# EAGLE design Silicoin (EAGLE 6.4)
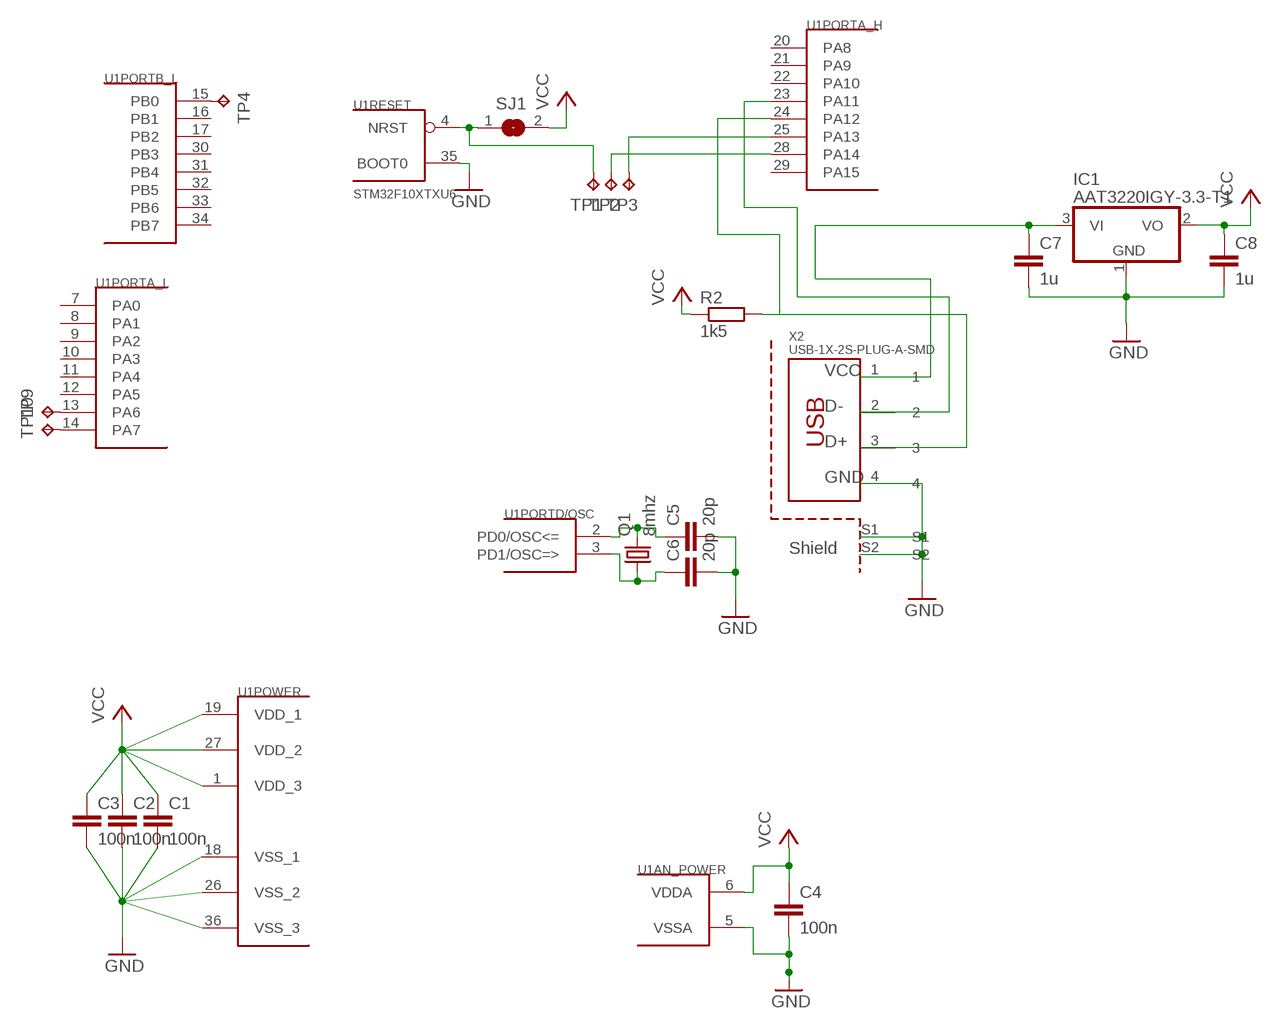
[diagram p0: schematic, sheet 1]

## Parts
C1  100n  C-EUC0603  [C0603]
C2  100n  C-EUC0603  [C0603]
C3  100n  C-EUC0603  [C0603]
C4  100n  C-EUC0603  [C0603]
C5  20p  C-EUC0603  [C0603]
C6  20p  C-EUC0603  [C0603]
C7  1u  C-EUC0603  [C0603]
C8  1u  C-EUC0603  [C0603]
IC1  AAT3220IGY-3.3-T1  MCP1703CB  [SOT23]
Q1  8mhz  CSM-7X-DU  [CSM-7X-DU]
R2  1k5  R-EU_R0603  [R0603]
SJ1  SJ  [SJ]
TP1  TPB2,54  [B2,54]
TP2  TPB2,54  [B2,54]
TP3  TPB2,54  [B2,54]
TP4  TPB2,54  [B2,54]
TP9  TPB2,54  [B2,54]
TP10  TPB2,54  [B2,54]
U1  STM32F10XTXU6  [VFQFPN36]
X2  USB-1X-2S-PLUG-A-SMD  [USB-PLUG-A-SMD-2S]

## Nets
GND: C1.2 C2.2 C3.2 C4.2 C5.2 C6.2 C7.2 C8.2 IC1.1(GND) U1.5(AN_POWER:VSSA) U1.18(POWER:VSS_1) U1.26(POWER:VSS_2) U1.35(RESET:BOOT0) U1.36(POWER:VSS_3) X2.4 X2.S1 X2.S2
N$1: TP4.TP U1.15(PORTB_L:PB0)
N$2: TP3.TP U1.25(PORTA_H:PA13)
N$3: SJ1.1 TP1.TP U1.4(RESET:NRST)
N$5: R2.2 U1.24(PORTA_H:PA12) X2.3
N$6: U1.23(PORTA_H:PA11) X2.2
N$7: C5.1 Q1.2 U1.2(PORTD/OSC:PD0/OSC<=)
N$8: C6.1 Q1.1 U1.3(PORTD/OSC:PD1/OSC=>)
N$10: C7.1 IC1.3(VI) X2.1
N$13: TP2.TP U1.28(PORTA_H:PA14)
N$14: TP9.TP U1.13(PORTA_L:PA6)
N$15: TP10.TP U1.14(PORTA_L:PA7)
VCC: C1.1 C2.1 C3.1 C4.1 C8.1 IC1.2(VO) R2.1 SJ1.2 U1.1(POWER:VDD_3) U1.6(AN_POWER:VDDA) U1.19(POWER:VDD_1) U1.27(POWER:VDD_2)
Unconnected: U1.7(PORTA_L:PA0) U1.8(PORTA_L:PA1) U1.9(PORTA_L:PA2) U1.10(PORTA_L:PA3) U1.11(PORTA_L:PA4) U1.12(PORTA_L:PA5) U1.16(PORTB_L:PB1) U1.17(PORTB_L:PB2) U1.20(PORTA_H:PA8) U1.21(PORTA_H:PA9) U1.22(PORTA_H:PA10) U1.29(PORTA_H:PA15) U1.30(PORTB_L:PB3) U1.31(PORTB_L:PB4) U1.32(PORTB_L:PB5) U1.33(PORTB_L:PB6) U1.34(PORTB_L:PB7)

## Library data of the parts
C1-C8 = rcl:C-EU: CAPACITOR, European symbol
IC1 = linear:MCP1703: 250 mA, 16V, Low Quiescent Current LDO Regulator Source: http://ww1.microchip.com/downloads/en/DeviceDoc/22049b.pdf
Q1 = crystal:CSM-7X-DU: SMD CRYSTAL Source: www.ecsxtal.com .. Crystal 3.6864MHz CSM_7X_DU.PDF; OC_FARNELL: unknown; OC_NEWARK: unknown
R2 = rcl:R-EU_: RESISTOR, European symbol
SJ1 = jumper:SJ: SMD solder JUMPER
TP1-TP4 TP9 TP10 = testpad:TP: Test pad
U1 = stm32:STM32F10XTXU6: STM32F101/103 36pad VFQPFN36
X2 = usb-con:USB-1X-2S

## Board
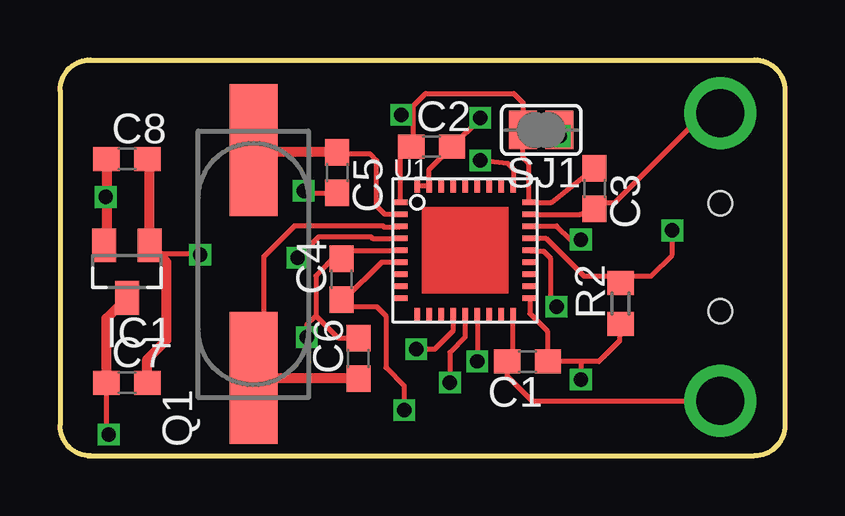
[diagram p1: board, top side]
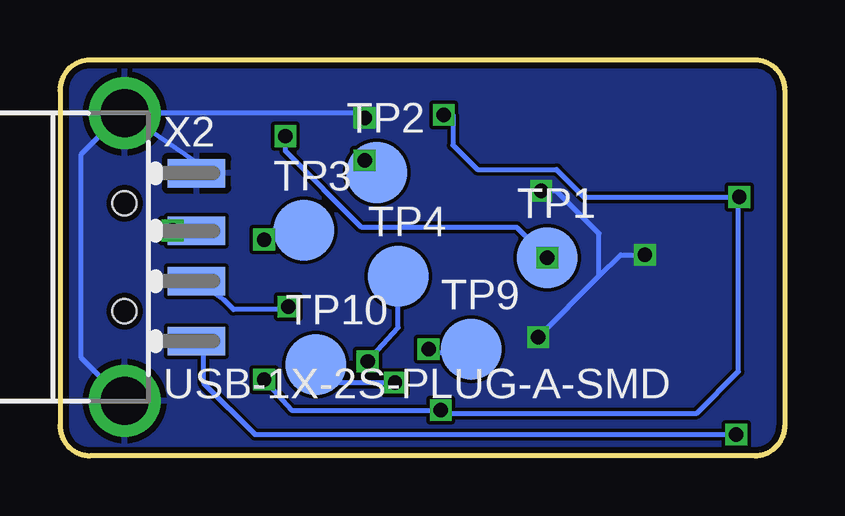
[diagram p2: board, bottom side, seen from below]

Size 30.23 x 16.51 mm. Coordinates in mm from the lower left corner, seen from the top.
Outline: 1.27,0 arc-90 0,1.27 0,15.24 arc-90 1.27,16.51 28.96,16.51 arc-90 30.23,15.24 30.23,1.27 arc-90 28.96,0 1.14,0
Copper layers (1*16): Top 0.035mm / dielectric 1.5mm / Bottom 0.035mm
Design rules "Fusion_eagle_rule_v1-1.1": minimum track width 6mil, minimum drill 12mil, track to track 6mil, track to pad 6mil, pad to pad 6mil, via to via 6mil, smd to smd 0mil, copper to edge 10mil, drill to drill 10mil, minimum pad ring 10mil, minimum via ring 6mil, stop-mask expansion 2mil, vias tented up to drill 100mil, thermal gap 10mil

### Footprints (pad centres in the part's own frame; a part is rotated, then mirrored left to right if it is on the bottom)
C0603 = smd 1.1 x 1: 1 -0.85,0; 2 0.85,0
SOT23 = smd 1 x 1.4: 1 -0.95,-1.1; 2 0.95,-1.1; 3 0,1.1
CSM-7X-DU = smd 5.5 x 2: 1 -4.75,0; 2 4.75,0
R0603 = smd 1 x 1.1: 1 -0.85,0; 2 0.85,0
SJ = smd 1.168 x 1.6: 1 -0.762,0; 2 0.762,0
B2,54 = smd 2.54 x 2.54: TP 0,0
VFQFPN36 = smd 0.6 x 0.23: 1 -2.7,2; 2 -2.7,1.5; 3 -2.7,1; 4 -2.7,0.5; 5 -2.7,0; 6 -2.7,-0.5; 7 -2.7,-1; 8 -2.7,-1.5; 9 -2.7,-2; 19 2.7,-2; 20 2.7,-1.5; 21 2.7,-1; 22 2.7,-0.5; 23 2.7,0; 24 2.7,0.5; 25 2.7,1; 26 2.7,1.5; 27 2.7,2 | smd 0.23 x 0.6: 10 -2,-2.7; 11 -1.5,-2.7; 12 -1,-2.7; 13 -0.5,-2.7; 14 0,-2.7; 15 0.5,-2.7; 16 1,-2.7; 17 1.5,-2.7; 18 2,-2.7; 28 2,2.7; 29 1.5,2.7; 30 1,2.7; 31 0.5,2.7; 32 0,2.7; 33 -0.5,2.7; 34 -1,2.7; 35 -1.5,2.7; 36 -2,2.7
USB-PLUG-A-SMD-2S = smd 2.4 x 1.2: 1 10.9,-3.6; 2 10.9,-1.1; 3 10.9,1; 4 10.9,3.4 | drill 2: S1 7.9,-6.1; S2 7.9,5.9 | hole 1: 7.9,-2.35; 7.9,2.15

### Placement (x,y rotation side)
C1  19.49,3.94 180 top
C2  15.49,12.89 0 top
C3  22.29,11.14 270 top
C4  11.75,7.37 90 top
C5  11.56,11.81 270 top
C6  12.45,4.06 90 top
C7  2.79,3.05 0 top
C8  2.79,12.38 0 top
IC1  2.79,7.68 180 top
Q1  8.06,8 90 top
R2  23.37,6.35 90 top
SJ1  20.07,13.59 180 top
TP1  9.91,8.26 0 bottom
TP2  17.02,11.81 0 bottom
TP3  20.07,9.4 0 bottom
TP4  16.13,7.49 0 bottom
TP9  13.08,4.45 0 bottom
TP10  19.56,3.81 0 bottom
U1  16.89,8.57 0 top
X2  35.43,8.38 0 bottom

### Tracks (layer width: path | path; a pad name or v marks a point on that pad's centre or on a via)
GND  (via drill 0.6)
  Top 0.203: U1.26 21.69,10.07 C3.2 22.15,10.54 23.11,10.54 26.86,14.28 X2.S2 | U1.36 U1.35 15.39,11.94 C2.2 17.53,14.07 v17.53,14.1 | X2.S1 26.39,2.29 19.69,2.29 18.64,3.33 C1.2 18.89,4.18 U1.18 | 10.67,5.84 11.6,4.91 C6.2 | U1.5 11.9,8.57 C4.2 11.56,8.41 10.67,7.52 10.67,5.84 | 10.67,5.84 10.29,5.46 v10.29,4.95 | v10.16,11.05 10.25,10.96 C5.2 | v5.84,8.38 5.8,8.42 4.11,8.42
  Top 0.406: C7.2 3.64,4.03 4.45,4.83 4.45,8.08 4.11,8.42 IC1.1 3.74,12.28 C8.2
  Bottom 0.203: X2.4 23.89,11.78 26.86,13.82 X2.S2 | v17.53,14.1 17.71,14.28 X2.S2 | v10.29,4.95 7.75,7.49 | 7.75,7.49 7.75,9.27 9.52,11.05 v10.16,11.05 | 7.75,7.49 6.86,8.38 v5.84,8.38 | X2.S1 29.34,4.09 29.34,12.57 27.63,14.28 X2.S2
  pour Bottom: 0,16.51 30.23,16.51 30.23,0 0,0
N$1  (via drill 0.6)
  Top 0.203: U1.15 v17.4,3.94
  Bottom 0.203: v17.4,3.94 16.13,5.33 TP4.TP
N$2  (via drill 0.6)
  Top 0.203: U1.25 19.61,9.59 20.7,9.59 21.27,9.02 v21.72,9.02
  Bottom 0.203: v21.72,9.02 21.34,9.4 TP3.TP
N$3  (via drill 0.6)
  Top 0.203: TP1.TP 10.79,9.14 12.95,9.14 13.02,9.07 U1.4 | v20.83,13.34 SJ1.1
  Bottom 0.203: v20.83,13.34 20.83,12.7 17.65,9.53 11.18,9.53 TP1.TP
  other vias: 9.91,8.26
N$5  (via drill 0.6)
  Top 0.203: U1.24 20,9.07 20,9.08 20.26,9.08 21.84,7.49 23.24,7.49 24.64,7.49 25.53,8.38 v25.53,9.4
  Top 0.406: R2.2 23.24,7.2 23.24,7.49
  Bottom 0.203: X2.3 25.51,9.38 v25.53,9.4
N$6  (via drill 0.6)
  Top 0.203: U1.23 19.62,8.54 20.16,8.54 20.45,8.26 20.45,6.35 20.57,6.22 v20.7,6.22
  Bottom 0.203: v20.7,6.22 20.83,6.1 22.99,6.1 23.39,6.5 X2.2
N$7
  Top 0.203: U1.2 13.55,10.07 13.21,10.41 13.21,12.32 12.95,12.57 11.64,12.57 C5.1
  Top 0.406: C5.1 8.15,12.66 Q1.2
N$8
  Top 0.203: 8,3.17 8.51,3.17 8.51,8.32 9.78,9.59 13.46,9.59 13.52,9.53 14.14,9.53 U1.3
  Top 0.406: C6.1 12.41,3.25 Q1.1 8,3.25 8,3.17
N$10  (via drill 0.6)
  Top 0.203: v2.03,0.89 1.94,0.98 C7.1
  Top 0.406: C7.1 1.94,5.73 IC1.3
  Bottom 0.203: X2.1 24.26,4.51 24.26,3.05 22.1,0.89 v2.03,0.89
N$13  (via drill 0.6)
  Top 0.203: U1.28 18.92,11.3 18.92,11.94 18.67,12.19 v17.53,12.32
  Bottom 0.203: v17.53,12.32 17.14,11.81 TP2.TP
N$14  (via drill 0.6)
  Top 0.203: U1.13 16.38,5.21 15.62,4.45 v14.86,4.45
  Bottom 0.203: v14.86,4.45 14.73,4.32 13.08,4.32 TP9.TP
N$15  (via drill 0.6)
  Top 0.203: U1.14 16.89,4.95 16.26,4.32 v16.26,3.05
  Bottom 0.203: v16.26,3.05 19.18,3.05 19.56,3.43 TP10.TP
VCC  (via drill 0.6)
  Top 0.203: U1.19 19.59,5.94 20.32,5.21 20.32,3.96 C1.1 21.72,3.94 | R2.1 23.33,4.79 22.48,3.94 21.72,3.94 | C3.1 20.49,10.57 U1.27 19.56,10.61 19.56,12.19 19.3,12.45 SJ1.2 | U1.1 14.19,12.44 C2.1 | SJ1.2 18.92,13.97 | U1.6 13.4,8.06 11.85,6.52 C4.1 12.04,6.22 13.21,6.22 13.59,5.84 13.59,3.68 14.35,2.92 v14.35,1.91 | 1.91,10.92 v1.91,10.79 1.94,10.79 | 21.72,3.94 v21.72,3.17 | C2.1 14.73,12.98 | 14.73,12.98 14.73,14.61 | 14.73,14.61 15.24,15.11 18.92,15.11 19.3,14.73 SJ1.2 | C2.1 14.73,12.89 14.73,12.98 | 14.73,14.61 v14.22,14.22
  Top 0.406: C8.1 1.94,10.79 1.94,8.88 IC1.2
  Bottom 0.203: 1.94,10.79 1.94,3.52 3.68,1.78 14.22,1.78 v14.35,1.91 20.57,1.91 v21.72,3.17 | 1.94,10.92 1.94,10.79 | 1.94,10.79 v1.91,10.79 8.38,10.79 9.52,11.94 12.83,11.94 13.84,12.95 13.84,14.22 v14.22,14.22

### Text on the board
bStop: github.com/silicoin | SILC Miner | V1.0 / STM32F103 / @72MHz